# Altium schematic sheet TUSB2036_PINOUT.SchDoc
size B; SheetNumber: 11; SheetTotal: 17
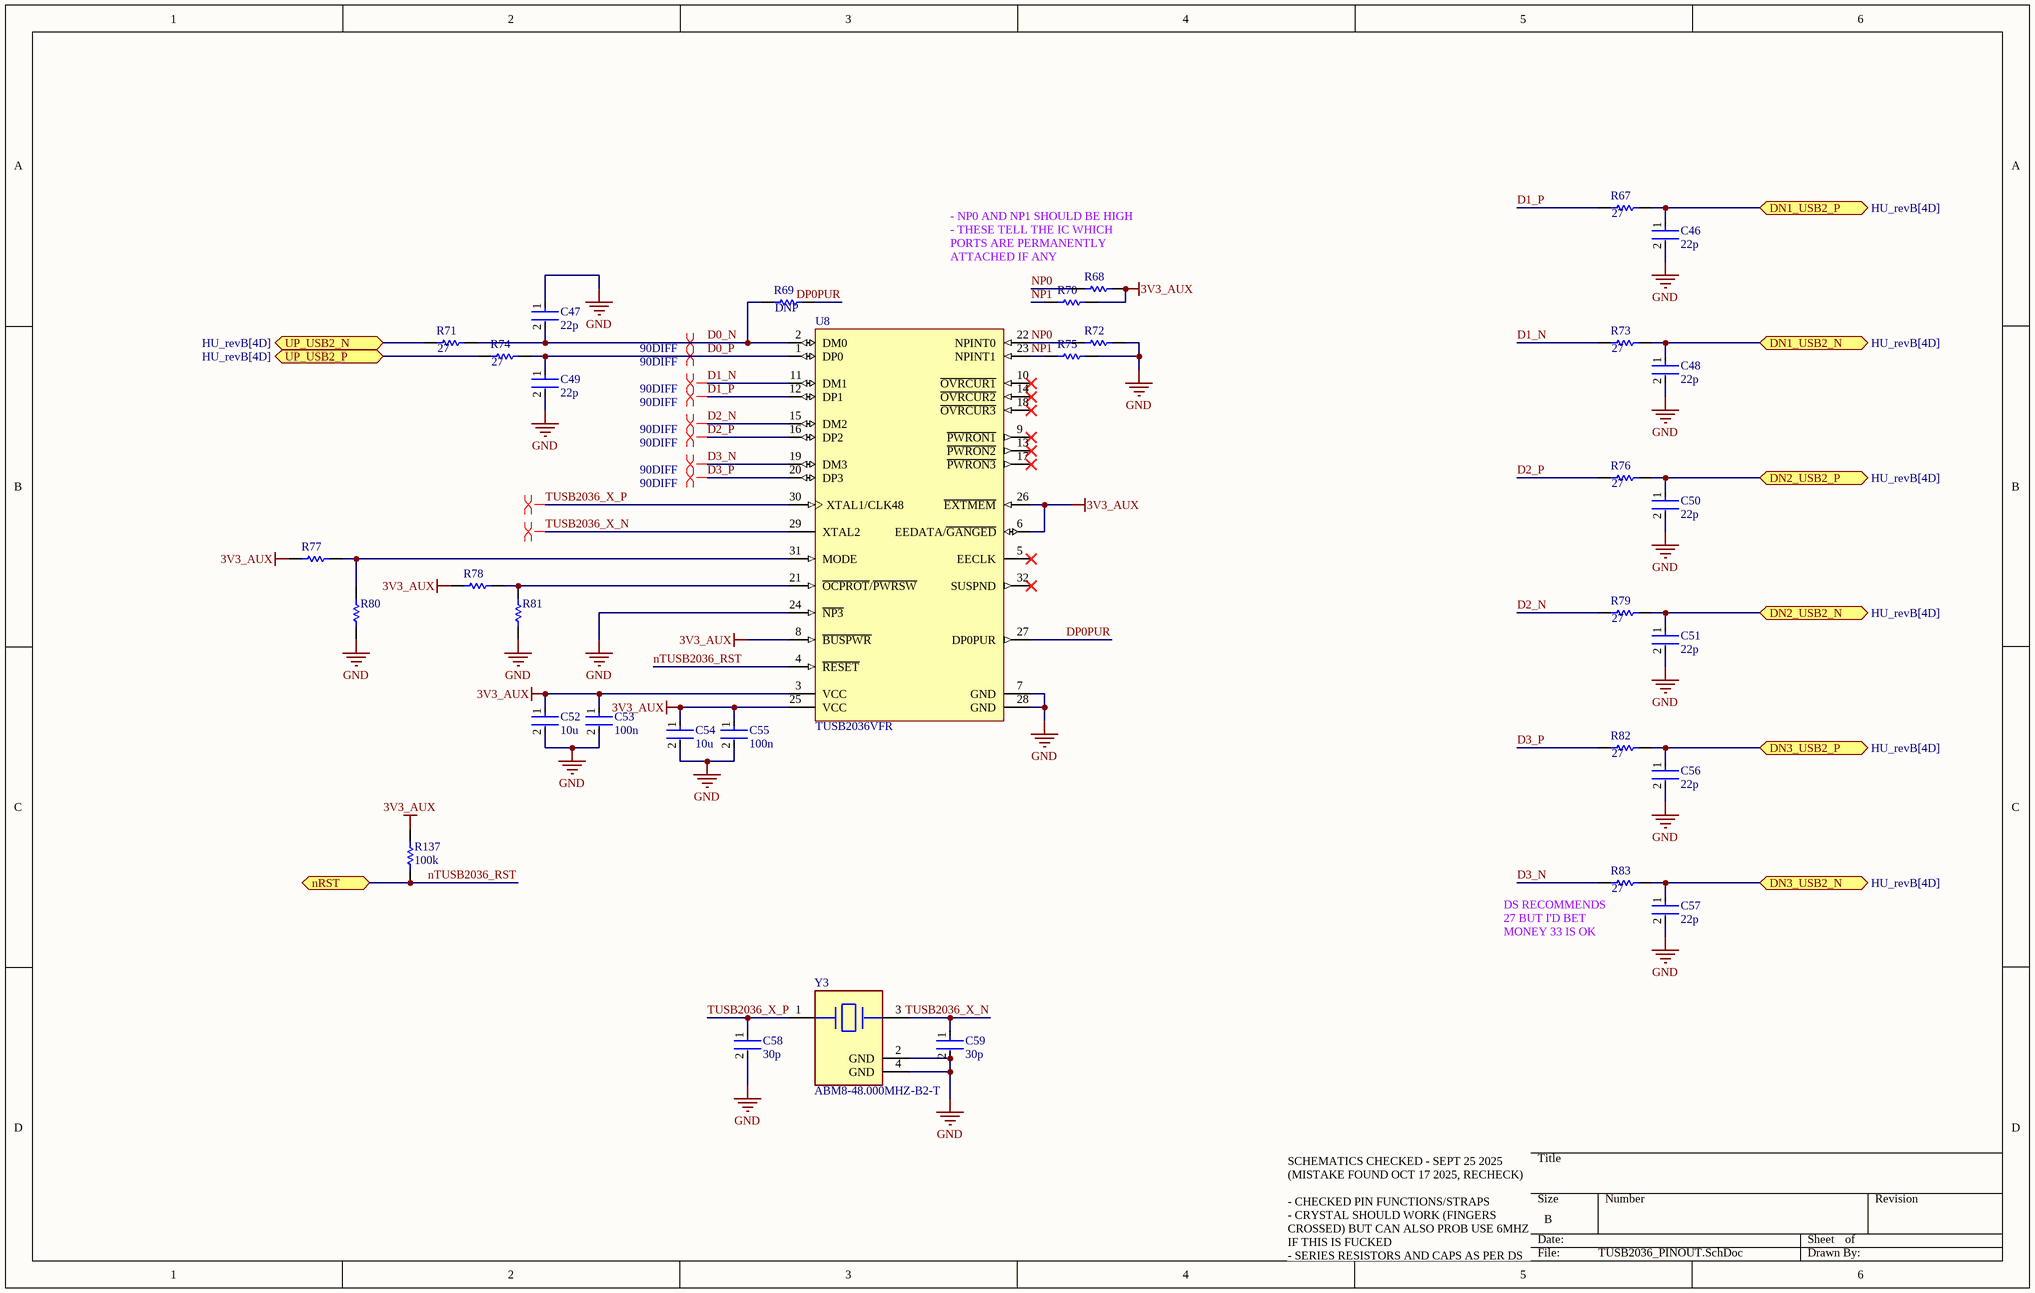
[diagram p0: TUSB2036_PINOUT.SchDoc]

## Parts
C46  22p  [FP-0402-L_1_0_0_05-W_0_5-IPC_A]
C47  22p  [FP-0402-L_1_0_0_05-W_0_5-IPC_A]
C48  22p  [FP-0402-L_1_0_0_05-W_0_5-IPC_A]
C49  22p  [FP-0402-L_1_0_0_05-W_0_5-IPC_A]
C50  22p  [FP-0402-L_1_0_0_05-W_0_5-IPC_A]
C51  22p  [FP-0402-L_1_0_0_05-W_0_5-IPC_A]
C52  10u  [FP-0402-L_1_0_0_05-W_0_5-IPC_A]
C53  100n  [FP-0402-L_1_0_0_05-W_0_5-IPC_A]
C54  10u  [FP-0402-L_1_0_0_05-W_0_5-IPC_A]
C55  100n  [FP-0402-L_1_0_0_05-W_0_5-IPC_A]
C56  22p  [FP-0402-L_1_0_0_05-W_0_5-IPC_A]
C57  22p  [FP-0402-L_1_0_0_05-W_0_5-IPC_A]
C58  30p  [FP-0402-L_1_0_0_05-W_0_5-IPC_A]
C59  30p  [FP-0402-L_1_0_0_05-W_0_5-IPC_A]
R67  27  [R0603B]
R68  0402 JUMPER  [RESC1005X40X25ML05T05]  (value not drawn)
R69  DNP  [R0603B]
R70  0402 JUMPER  [RESC1005X40X25ML05T05]  (value not drawn)
R71  27  [R0603B]
R72  0402 JUMPER  [RESC1005X40X25ML05T05]  (value not drawn)
R73  27  [R0603B]
R74  27  [R0603B]
R75  0402 JUMPER  [RESC1005X40X25ML05T05]  (value not drawn)
R76  27  [R0603B]
R77  0402 JUMPER  [RESC1005X40X25ML05T05]  (value not drawn)
R78  0402 JUMPER  [RESC1005X40X25ML05T05]  (value not drawn)
R79  27  [R0603B]
R80  DNP  [RESC1005X40X25ML05T05]  (value not drawn)
R81  DNP  [RESC1005X40X25ML05T05]  (value not drawn)
R82  27  [R0603B]
R83  27  [R0603B]
R137  100k  [R0603B]
U8  TUSB2036VFR  [VF0032A_M]
Y3  ABM8-48.000MHZ-B2-T  [FP-ABM8-MFG]

## Ports
DN1_USB2_N (bidir, see HU_revB[4D]), DN1_USB2_P (bidir, see HU_revB[4D]), DN2_USB2_N (bidir, see HU_revB[4D]), DN2_USB2_P (bidir, see HU_revB[4D]), DN3_USB2_N (bidir, see HU_revB[4D]), DN3_USB2_P (bidir, see HU_revB[4D]), nRST (bidir), UP_USB2_N (bidir, see HU_revB[4D]), UP_USB2_P (bidir, see HU_revB[4D])

## Nets
3V3_AUX: C52.1 C53.1 C54.1 C55.1 R68.2 R70.2 R77.2 R78.2 R137.2 U8.3(VCC) U8.6(EEDATA/~{GANGED}) U8.8(~{BUSPWR}) U8.25(VCC) U8.26(~{EXTMEM})
GND: C46.2 C47.1 C48.2 C49.2 C50.2 C51.2 C52.2 C53.2 C54.2 C55.2 C56.2 C57.2 C58.2 C59.2 R72.2 R75.2 R80.1 R81.1 U8.7(GND) U8.24(~{NP3}) U8.28(GND) Y3.2(GND) Y3.4(GND)
D0_N: C47.2 R69.2 R71.1 U8.2(DM0)
D0_P: C49.1 R74.1 U8.1(DP0)
D1_N: R73.2 U8.11(DM1)
D1_P: R67.2 U8.12(DP1)
D2_N: R79.2 U8.15(DM2)
D2_P: R76.2 U8.16(DP2)
D3_N: R83.2 U8.19(DM3)
D3_P: R82.2 U8.20(DP3)
DN1_USB2_N: C48.1 R73.1 ; port DN1_USB2_N
DN1_USB2_P: C46.1 R67.1 ; port DN1_USB2_P
DN2_USB2_N: C51.1 R79.1 ; port DN2_USB2_N
DN2_USB2_P: C50.1 R76.1 ; port DN2_USB2_P
DN3_USB2_N: C57.1 R83.1 ; port DN3_USB2_N
DN3_USB2_P: C56.1 R82.1 ; port DN3_USB2_P
DP0PUR: R69.1 U8.27(DP0PUR)
NP0: R68.1 R72.1 U8.22(NPINT0)
NP1: R70.1 R75.1 U8.23(NPINT1)
nTUSB2036_RST: R137.1 U8.4(~{RESET}) ; port nRST
TUSB2036_X_N: C59.1 U8.29(XTAL2) Y3.3
TUSB2036_X_P: C58.1 U8.30(XTAL1/CLK48) Y3.1
UP_USB2_N: R71.2 ; port UP_USB2_N
UP_USB2_P: R74.2 ; port UP_USB2_P
NetR77_1: R77.1 R80.2 U8.31(MODE)
NetR78_1: R78.1 R81.2 U8.21(~{OCPROT}/~{PWRSW})

Not connected (* = marked no-connect by the designer): U8 5(EECLK)* 9(~{PWRON1})* 10(~{OVRCUR1})* 13(~{PWRON2})* 14(~{OVRCUR2})* 17(~{PWRON3})* 18(~{OVRCUR3})* 32(SUSPND)*

## Layout directives
differential pair: TUSB2036_X_N, TUSB2036_X_P
differential pair; differential pair class 90DIFF: D0_N, D0_P, D1_N, D1_P, D2_N, D2_P, D3_N, D3_P

## Notes on the sheet
- - NP0 AND NP1 SHOULD BE HIGH
  - THESE TELL THE IC WHICH PORTS ARE PERMANENTLY ATTACHED IF ANY
- (near R83) DS RECOMMENDS 27 BUT I'D BET MONEY 33 IS OK
- SCHEMATICS CHECKED - SEPT 25 2025 (MISTAKE FOUND OCT 17 2025, RECHECK)
  - CHECKED PIN FUNCTIONS/STRAPS
  - CRYSTAL SHOULD WORK (FINGERS CROSSED) BUT CAN ALSO PROB USE 6MHZ IF THIS IS FUCKED
  - SERIES RESISTORS AND CAPS AS PER DS

## Library data of the parts
C46-C59 = CMP-001-00058-1: LARGE PADS, 0402 CAP, CHANGE COMMENT TO MATCH REAL P/N; Capacitor Type: Ceramic; Min Operating Temperature: -55°C; Mounting Technology: Surface Mount; Pins: 2; Case/Package: 0402; RoHS Compliant: Yes; Max Operating Temperature: 85°C
R67 R69 R71 R73 R74 R76 R79 R82 R83 R137 = CMP-009-00002-14: Resistor
  R67 R71 R73 R74 R76 R79 R82 R83: Value: 27
  R69: Value: DNP
R68 R70 R72 R75 R77 R78 R80 R81 = CMP-009-00118-2: READ THE NAME; Pins: 2; Component Type: Standard; Design Item ID: CMP-009-00206-2; Source: 0402jump.SchLib
U8 = CMP-0309-00082-2: 2 / 3-Port Hub for USB with Optional Serial EEPROM Interface, 3.3V, 0 to 70 degC, 32-Pin LQFP (VF), Green (RoHS & no Sb/Br); Manufacturer: Texas Instruments; Supply Voltage(s)(V): 3.3; SubFamily: USB Hub Controller; USB Speed: Full; USB Full Speed: True; PackageReference: VF0032A; ComponentLink2URL: http://www.ti.com/litv/pdf/mtqf002b; PackageDescription: 32-Pin Plastic Quad Flatpack, 7 x 7 mm Body, 0.8 mm Pitch; Integrated MCU Architecture: N/A; DatasheetVersion: SLLS372E; ComponentLink1URL: http://www.ti.com/general/docs/lit/getliterature.tsp?genericPartNumber=TUSB2036&fileType=pdf; Eco-Plan: Green (RoHS & no Sb/Br); PartNumber: TUSB2036VFR; Mounting Technology: Surface Mount; ComponentLink1Description: Datasheet; PackageVersion: revD, Apr-2000; ComponentLink2Description: Package Specification
Y3 = CMP-27762-011708-1: Crystal 48MHz ±20ppm 18pF SMD-4 3.2mm x 2.5mm; Series Resistance: 35R; Frequency Stability: 50ppm; Package Quantity: 1000; Packaging: Tape and Reel; Mount: Surface Mount; Length: 3.2mm; Load Capacitance: 18pF; Max Operating Temperature: 70°C; Operating Frequency: 48 MHz; RoHS Compliant: Yes; Series: ABM8; Frequency Tolerance: 20ppm; Lead Free: Lead Free; Min Operating Temperature: -20°C; Case/Package: CSMD; Number of Pins: 4; Height: 0.031inch; ESR (Equivalent Series Resistance): 35R; Frequency: 48MHz; Radiation Hardening: No; Width: 0.098inch; Tolerance: 20ppm; Termination: SMD/SMT; Depth: 2.5mm; Resistor Type: Ceramic; REACH SVHC: No SVHC